# EAGLE design schematic (EAGLE 6.5.0)
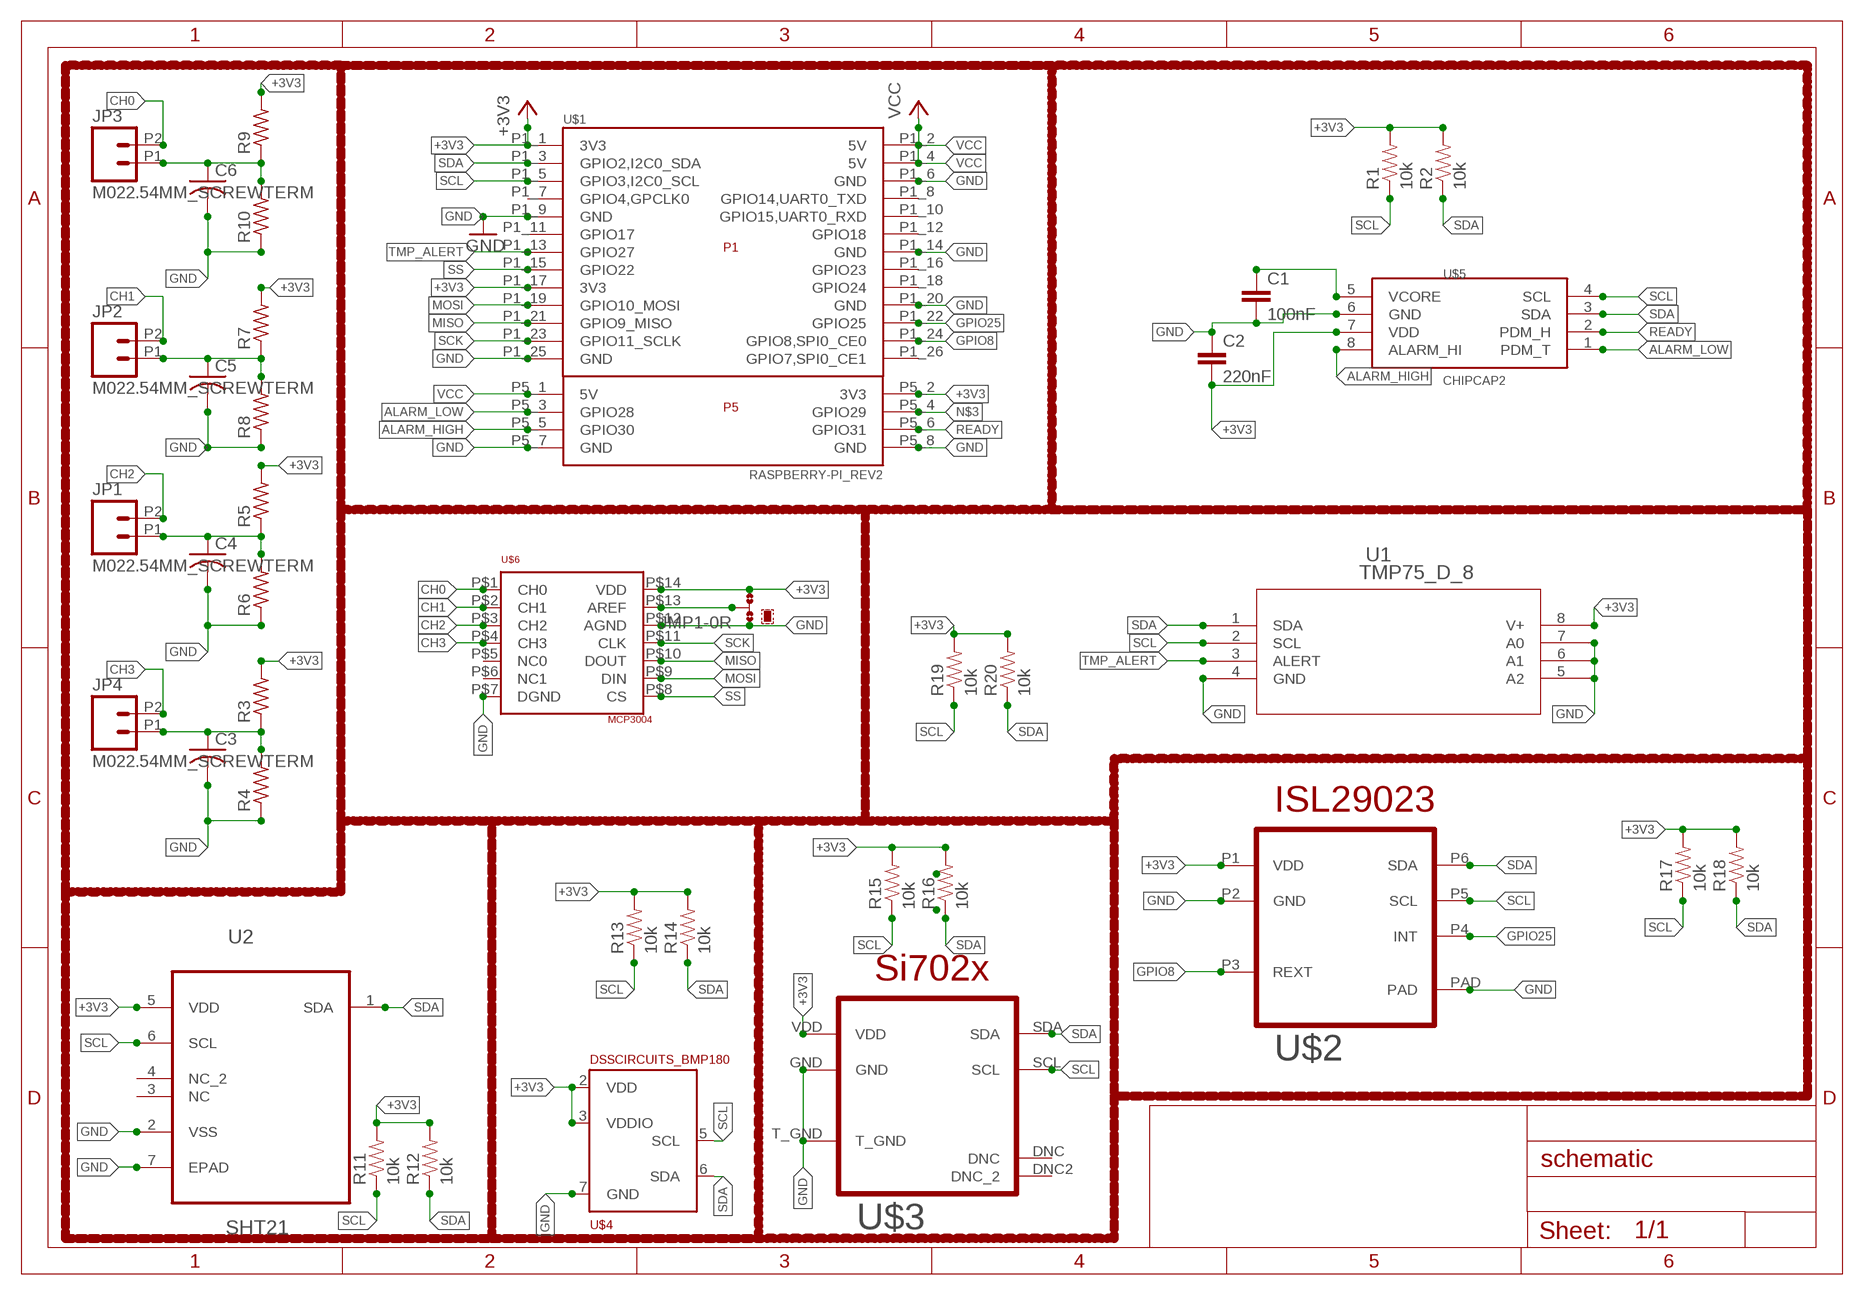
[diagram p0: schematic, sheet 1]

## Parts
C1  100nF  CAP0402-CAP  [0402-CAP]
C2  220nF  CAP0402-CAP  [0402-CAP]
C3  C-USC0402  [C0402]
C4  C-USC0402  [C0402]
C5  C-USC0402  [C0402]
C6  C-USC0402  [C0402]
JMP1  0R-JUMPA  [A0R-JMP]
JP1  M022.54MM_SCREWTERM  [1X02_2.54_SCREWTERM]
JP2  M022.54MM_SCREWTERM  [1X02_2.54_SCREWTERM]
JP3  M022.54MM_SCREWTERM  [1X02_2.54_SCREWTERM]
JP4  M022.54MM_SCREWTERM  [1X02_2.54_SCREWTERM]
R1  10k  RESISTOR0603  [0603-RES]
R2  10k  RESISTOR0603  [0603-RES]
R3  R-US_R0402  [R0402]
R4  R-US_R0402  [R0402]
R5  R-US_R0402  [R0402]
R6  R-US_R0402  [R0402]
R7  R-US_R0402  [R0402]
R8  R-US_R0402  [R0402]
R9  R-US_R0402  [R0402]
R10  R-US_R0402  [R0402]
R11  10k  RESISTOR0603  [0603-RES]
R12  10k  RESISTOR0603  [0603-RES]
R13  10k  RESISTOR0603  [0603-RES]
R14  10k  RESISTOR0603  [0603-RES]
R15  10k  RESISTOR0603  [0603-RES]
R16  10k  RESISTOR0603  [0603-RES]
R17  10k  RESISTOR0603  [0603-RES]
R18  10k  RESISTOR0603  [0603-RES]
R19  10k  RESISTOR0603  [0603-RES]
R20  10k  RESISTOR0603  [0603-RES]
U1  TMP75_D_8  [D8]
U2  SHT21  [DFN300X300X110-7N]
U$1  RASPBERRY-PI_REV2  [RASPBERRY-PI_REV2]
U$2  ISL29023  [ODFN6]
U$3  SI702X  [DFN6]
U$4  DSSCIRCUITS_BMP180  [DSSCIRCUITS_LGA7]
U$5  CHIPCAP2  [CHIPCAP2]
U$6  MCP3004  [TSSOP14_4MM4]

## Nets
+3V3 [PWR]: C2.2 JMP1.3 R1.2 R2.2 R3.2 R5.2 R7.2 R9.2 R11.2 R12.2 R13.2 R14.2 R15.2 R16.2 R17.2 R18.2 R19.2 R20.2 U1.8(V+) U2.5(VDD) U$1.P1_1(3V3) U$1.P1_17(3V3) U$1.P5_2(3V3) U$2.P1(VDD) U$3.VDD U$4.2(VDD) U$4.3(VDDIO) U$5.7(VDD) U$6.P$14(VDD)
ALARM_HIGH: U$1.P5_5(GPIO30) U$5.8(ALARM_HI)
ALARM_LOW: U$1.P5_3(GPIO28) U$5.1(PDM_T)
CH0: JP3.P2 U$6.P$1(CH0)
CH1: JP2.P2 U$6.P$2(CH1)
CH2: JP1.P2 U$6.P$3(CH2)
CH3: JP4.P2 U$6.P$4(CH3)
GND [PWR]: C1.2 C2.1 C3.2 C4.2 C5.2 C6.2 JMP1.1 R4.1 R6.1 R8.1 R10.1 U1.4(GND) U1.5(A2) U1.6(A1) U1.7(A0) U2.2(VSS) U2.7(EPAD) U$1.P1_6(GND) U$1.P1_9(GND) U$1.P1_14(GND) U$1.P1_20(GND) U$1.P1_25(GND) U$1.P5_7(GND) U$1.P5_8(GND) U$2.P2(GND) U$2.PAD U$3.GND U$3.T_GND U$4.7(GND) U$5.6(GND) U$6.P$7(DGND) U$6.P$12(AGND)
GPIO8: U$1.P1_24(GPIO8,SPI0_CE0) U$2.P3(REXT)
GPIO25: U$1.P1_22(GPIO25) U$2.P4(INT)
MISO: U$1.P1_21(GPIO9_MISO) U$6.P$10(DOUT)
MOSI: U$1.P1_19(GPIO10_MOSI) U$6.P$9(DIN)
N$1: C4.1 JP1.P1 R5.1 R6.2
N$2: C5.1 JP2.P1 R7.1 R8.2
N$3: U$1.P5_4(GPIO29)
N$4: C6.1 JP3.P1 R9.1 R10.2
N$5: C1.1 U$5.5(VCORE)
N$12: C3.1 JP4.P1 R3.1 R4.2
N$17: JMP1.2 U$6.P$13(AREF)
READY: U$1.P5_6(GPIO31) U$5.2(PDM_H)
SCK: U$1.P1_23(GPIO11_SCLK) U$6.P$11(CLK)
SCL: R1.1 R11.1 R13.1 R15.1 R17.1 R19.1 U1.2(SCL) U2.6(SCL) U$1.P1_5(GPIO3,I2C0_SCL) U$2.P5(SCL) U$3.SCL U$4.5(SCL) U$5.4(SCL)
SDA: R2.1 R12.1 R14.1 R16.1 R18.1 R20.1 U1.1(SDA) U2.1(SDA) U$1.P1_3(GPIO2,I2C0_SDA) U$2.P6(SDA) U$3.SDA U$4.6(SDA) U$5.3(SDA)
SS: U$1.P1_15(GPIO22) U$6.P$8(CS)
TMP_ALERT: U1.3(ALERT) U$1.P1_13(GPIO27)
VCC [PWR]: U$1.P1_2(5V) U$1.P1_4(5V) U$1.P5_1(5V)
Unconnected: U2.3(NC) U2.4(NC_2) U$1.P1_7(GPIO4,GPCLK0) U$1.P1_8(GPIO14,UART0_TXD) U$1.P1_10(GPIO15,UART0_RXD) U$1.P1_11(GPIO17) U$1.P1_12(GPIO18) U$1.P1_16(GPIO23) U$1.P1_18(GPIO24) U$1.P1_26(GPIO7,SPI0_CE1) U$3.DNC U$3.DNC2(DNC_2) U$4.1 U$4.4 U$6.P$5(NC0) U$6.P$6(NC1)

## Library data of the parts
C1 C2 = weatherpilot_lbr:CAP: Capacitor Standard 0603 ceramic capacitor, and 0.1" leaded capacitor.
C3-C6 = rcl:C-US: CAPACITOR, American symbol
JMP1 = jump-0r-smd:0R-JUMP: SMD 0R 0805 Jumper
JP1-JP4 = SparkFun-Connectors:M02: Standard 2-pin 0.1" header. Use with - straight break away headers ( PRT-00116) - right angle break away headers (PRT-00553) - swiss pins (PRT-00743) - machine pins (PRT-00117) - female headers (PRT-00115) Molex polarized connector foot print use with: PRT-08233 with associated crimp pins and housings. 2.54_SCREWTERM for use with PRT-10571. 3.5mm Screw Terminal footprints for PRT-08084 5mm Screw Terminal footprints for use with PRT-08433
R1 R2 R11-R20 = SparkFun-Resistors:RESISTOR: Resistor Basic schematic elements and footprints for 0603, 1206, and PTH resistors.
R3-R10 = rcl:R-US_: RESISTOR, American symbol
U1 = libraryPart:TMP75_D_8; DATASHEETURL: http://www.ti.com/lit/gpn/TMP75; DESCRIPTION: Digital Temperature Sensor with 2-Wire Interface; FAMILY_NAME: TEMPERATURE SENSOR; GENERIC_PART_NUMBER: TMP75; INDUSTRY_STD_PKG_TYPE: SOIC; MANUFACTURER: Texas Instruments; MANUFACTURER_PART_NUMBER: tmp75_d_8; PACKAGE_DESIGNATOR: D; PIN_COUNT: 8; VENDOR: Texas Instruments
U2 = weatherpilot_lbr:SHT21: SENSOR, HUMIDITY & TEMP; MPN: SHT21; OC_FARNELL: 1855468; OC_NEWARK: 20T1172; PACKAGE: DFN-6; SUPPLIER: SENSIRION
U$1 = RaspberryPi:RASPBERRY-PI_REV2: Raspberry Pi Board <http://www.raspberrypi.org/> Jacques Lagnel V1.0 (beta) 2012 Mateusz Bawaj V1.1 (beta) 2012 Board dimension: Forum 3D model <http://www.raspberrypi.org/forum/general-discussion/mechanical-profile-3d-models?value=3d%20model&type=1&include=1&search=1&ret=all> The GPIO Connector (P1): http://elinux.org/RPi_Low-level_peripherals The GPIO Connector (P5): http://www.raspberrypi-spy.co.uk/2012/09/raspberry-pi-p5-header/
U$2 = weatherpilot_lbr:ISL29023
U$3 = weatherpilot_lbr:SI702X
U$4 = BMP180_Breakout_PCB_Rev_B:DSSCIRCUITS_BMP180
U$5 = lib:CHIPCAP2
U$6 = lib:MCP3004: The Microchip Technology Inc. MCP3004/3008 devices are successive approximation 10-bit Analogto-Digital (A/D) converters with on-board sample and hold circuitry. The MCP3004 is programmable to provide two pseudo-differential input pairs or four single-ended inputs. The MCP3008 is programmable to provide four pseudo-differential input pairs or eight single-ended inputs. Differential Nonlinearity (DNL) and Integral Nonlinearity (INL) are specified at ±1 LSB. Communication with the devices is accomplished using a simple serial interface compatible with the SPI protocol. The devices are capable of conversion rates of up to 200 ksps. The MCP3004/3008 devices operate over a broad voltage range (2.7V - 5.5V). Low-current design permits operation with typical standby currents of only 5 nA and typical active currents of 320 µA. The MCP3004 is offered in 14-pin PDIP, 150 mil SOIC and TSSOP packages, while the MCP3008 is offered in 16-pin PDIP and SOIC packages. Features • 10-bit resolution • ± 1 LSB max DNL • ± 1 LSB max INL • 4 (MCP3004) or 8 (MCP3008) input channels • Analog inputs programmable as single-ended or pseudo-differential pairs • On-chip sample and hold • SPI serial interface (modes 0,0 and 1,1) • Single supply operation: 2.7V - 5.5V • 200 ksps max. sampling rate at VDD=5V • 75 ksps max. sampling rate at VDD=2.7V • Low power CMOS technology • 5 nA typical standby current, 2 µA max. • 500 µA max. active current at 5V • Industrial temp range: -40°C to +85°C • Available in PDIP, SOIC and TSSOP packages

## Net classes
0 default: width 0.203 mm, drill 0.305 mm, clearance 0.152 mm
1 PWR: width 0.305 mm, drill 0.305 mm, clearance 0.152 mm

## Board
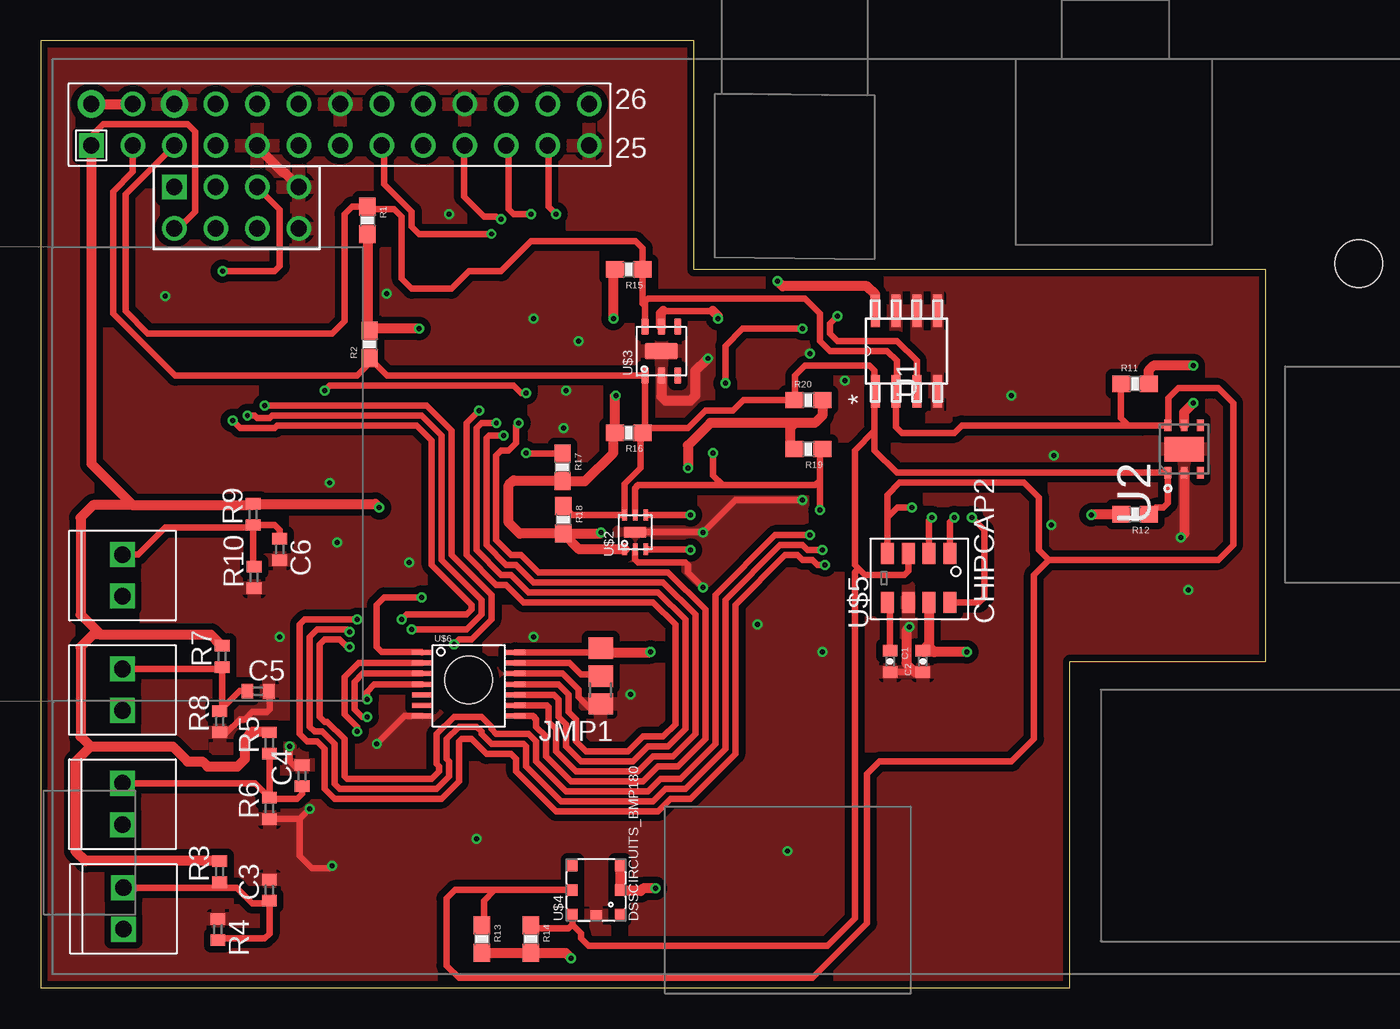
[diagram p1: board, top side]
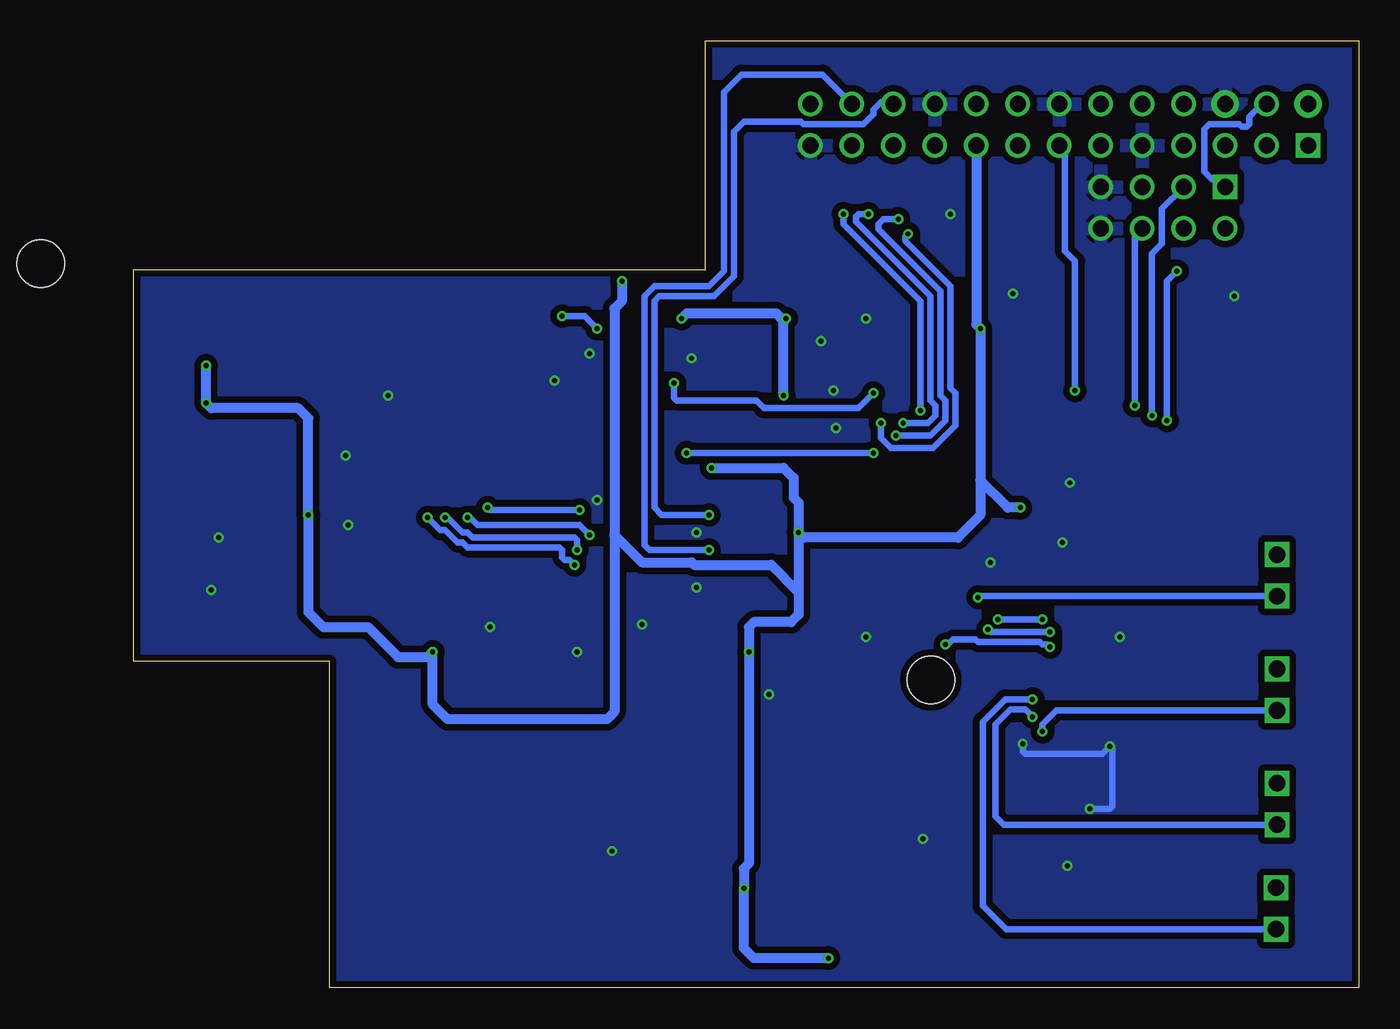
[diagram p2: board, bottom side, seen from below]

Size 75 x 58 mm. Coordinates in mm from the lower left corner, seen from the top.
Outline: 0,0 63,0 63,20 75,20 75,44 40,44 40,58 0,58 0,0
Copper layers (1*16): Top 0.035mm / dielectric 1.5mm / Bottom 0.035mm
Design rules "smart prototyping": minimum track width 6mil, minimum drill 12mil, track to track 6mil, track to pad 6mil, pad to pad 6mil, via to via 6mil, smd to smd 0mil, copper to edge 10mil, drill to drill 10mil, minimum pad ring 6mil, minimum via ring 6mil, stop-mask expansion 2mil, vias tented up to drill 25mil, thermal gap 10mil

### Footprints (pad centres in the part's own frame; a part is rotated, then mirrored left to right if it is on the bottom)
0402-CAP = smd 0.7 x 0.9: 1 -0.65,0; 2 0.65,0
C0402 = smd 0.7 x 0.9: 1 -0.65,0; 2 0.65,0
A0R-JMP = smd 1.5 x 1.3: 1 0,1.7; 2 0,0; 3 0,-1.7
1X02_2.54_SCREWTERM = drill 1.016 square: P1 2.54,0; P2 0,0
0603-RES = smd 1.1 x 1: 1 -0.85,0; 2 0.85,0
R0402 = smd 0.7 x 0.9: 1 -0.65,0; 2 0.65,0
D8 = smd 1.981 x 0.559: 1 -2.464,1.905; 2 -2.464,0.635; 3 -2.464,-0.635; 4 -2.464,-1.905; 5 2.464,-1.905; 6 2.464,-0.635; 7 2.464,0.635; 8 2.464,1.905
DFN300X300X110-7N = smd 0.711 x 0.406: 1 -1.448,0.991; 2 -1.448,0; 3 -1.448,-0.991; 4 1.448,-0.991; 5 1.448,0; 6 1.448,0.991 | smd 1.499 x 2.388: 7 0,0
RASPBERRY-PI_REV2 = drill 1 square: P1_1 -41.91,21.59; P5_1 -36.83,19.05 | drill 1 pad 1.676: P1_2 -41.91,24.13; P1_6 -36.83,24.13 | drill 1: P1_3 -39.37,21.59; P1_4 -39.37,24.13; P1_5 -36.83,21.59; P1_7 -34.29,21.59; P1_8 -34.29,24.13; P1_9 -31.75,21.59; P1_10 -31.75,24.13; P1_11 -29.21,21.59; P1_12 -29.21,24.13; P1_13 -26.67,21.59; P1_14 -26.67,24.13; P1_15 -24.13,21.59; P1_16 -24.13,24.13; P1_17 -21.59,21.59; P1_18 -21.59,24.13; P1_19 -19.05,21.59; P1_20 -19.05,24.13; P1_21 -16.51,21.59; P1_22 -16.51,24.13; P1_23 -13.97,21.59; P1_24 -13.97,24.13; P1_25 -11.43,21.59; P1_26 -11.43,24.13; P5_2 -36.83,16.51; P5_3 -34.29,19.05; P5_4 -34.29,16.51; P5_5 -31.75,19.05; P5_6 -31.75,16.51; P5_7 -29.21,19.05; P5_8 -29.21,16.51 | hole 2.9: 35.69,14.365; -18.81,-11.135
ODFN6 = smd 0.7 x 0.35: P1 -1.05,0.65; P2 -1.05,0; P3 -1.05,-0.65; P4 1.05,-0.65; P5 1.05,0; P6 1.05,0.65 | smd 0.65 x 1.35: PAD 0,0
DFN6 = smd 1 x 0.45: DNC -1.5,-1; DNC2 1.5,-1; GND -1.5,0; SCL 1.5,1; SDA -1.5,1; VDD 1.5,0 | smd 1 x 2: T_GND 0,0
DSSCIRCUITS_LGA7 = smd 0.7 x 0.6: 1 -1.5,-1.45; 2 0,-1.45; 3 1.5,-1.45; 4 1.5,1.45; 5 0,1.45; 6 -1.5,1.45 | smd 0.6 x 0.7: 7 -1.55,0
CHIPCAP2 = smd 1.27 x 0.8: 1 1.603,-1.651; 2 1.603,-0.381; 3 1.603,0.889; 4 1.603,2.159; 5 -1.397,2.159; 6 -1.397,0.889; 7 -1.397,-0.381; 8 -1.397,-1.651
TSSOP14_4MM4 = smd 1.25 x 0.3: P$1 -0.65,4.55; P$2 -0.65,3.9; P$3 -0.65,3.25; P$4 -0.65,2.6; P$5 -0.65,1.95; P$6 -0.65,1.3; P$7 -0.65,0.65; P$8 5.05,0.65; P$9 5.05,1.3; P$10 5.05,1.95; P$11 5.05,2.6; P$12 5.05,3.25; P$13 5.05,3.9; P$14 5.05,4.55

### Placement (x,y rotation side)
C1  52,20 270 top
C2  54,20 90 top
C3  14,6 90 top
C4  16,13 90 top
C5  13.31,18.18 0 top
C6  14.63,26.85 270 top
JMP1  34.28,19.1 180 top
JP1  5,10 90 top
JP2  5,17 90 top
JP3  5,24 90 top
JP4  5.06,3.6 90 top
R1  20,47 270 top
R2  20.13,39.41 90 top
R3  10.95,7.13 90 top
R4  10.85,3.58 270 top
R5  14,15 90 top
R6  14,11 90 top
R7  11.1,20.3 90 top
R8  10.95,16.31 90 top
R9  13,29 90 top
R10  13.06,25.14 90 top
R11  67,37 0 top
R12  67,29 180 top
R13  27,3 270 top
R14  30,3 270 top
R15  36,44 180 top
R16  36,34 180 top
R17  31.94,31.89 270 top
R18  32,28.68 270 top
R19  47,33 180 top
R20  47,36 0 top
U1  53,39 90 top
U2  70,33 90 top
U$1  45,30 0 top
U$2  36.39,27.91 90 top
U$3  38,39 90 top
U$4  34,6 90 top
U$5  54,25 90 top
U$6  24,16 0 top

### Tracks (layer width: path | path; a pad name or v marks a point on that pad's centre or on a via)
+3V3  (via drill 0.3)
  Top 0.406: U$6.P$14 34.02,20.55 JMP1.3 | 41.15,41.45 38.1,41.45 | U$1.P5_2 8.41,46.51 9.45,47.55 9.45,52.43 8.99,52.88 3.81,52.88 3.05,52.12 3.05,51.63 U$1.P1_1
  Top 0.61: U$1.P1_1 3.09,32.11 5.64,29.57 | 5.64,29.57 12.92,29.57 R9.2 20.49,29.65 v20.73,29.41 | 5.64,29.57 3.2,29.57 2.44,28.8 2.44,22.86 3.66,21.64 | 3.66,21.64 10.36,21.64 | 10.36,21.64 10.41,21.64 R7.2 11.05,20.95 10.36,21.64 | 3.66,21.64 3.2,21.64 2.44,20.88 2.44,15.39 3.05,14.78 | 3.05,14.78 8.08,14.78 8.99,13.87 9.91,13.87 10.21,13.56 12.04,13.56 12.5,14.02 12.5,15.24 12.95,15.7 13.95,15.7 R5.2 | R3.2 2.74,7.78 2.13,8.38 2.13,13.87 3.05,14.78 | R13.2 R14.2 32.14,2.15 v32.46,1.83 | v37.64,6.1 36.88,6.1 36.73,5.94 35.51,5.94 U$4.2 U$4.3 | 34.02,20.55 37.31,20.55 v37.34,20.57 | U$2.P1 32.96,26.86 R18.2 | R18.2 34.23,27.83 v34.29,27.89 | R18.2 29.32,27.83 28.65,28.5 28.65,30.79 28.96,31.09 31.89,31.09 R17.2 33.32,31.04 35.05,32.77 35.05,33.9 R16.2 35.15,36.22 v35.2,36.27 | v35.05,41 35.05,43.9 R15.2 | v41.45,41 41.45,41.15 41.15,41.45 | 38.1,41.45 37.95,41.3 37.95,40.55 U$3.VDD | R20.2 47.85,35.05 47.4,34.59 46.18,34.59 | 46.18,34.59 45.87,34.29 45.87,33.28 R19.2 | 46.18,34.59 41,34.59 39.62,33.22 v39.62,31.85 | U1.8 51.09,42.48 50.6,42.98 45.41,42.98 v45.11,43.28 | U2.5 70,35.25 v70.56,35.81 | v70.56,38.1 68.12,38.1 67.82,37.8 67.82,37.03 R11.2 | R12.2 64.36,29 v64.31,28.96 | v56.69,20.57 54.71,20.57 | 54.71,20.57 54.08,20.57 C2.2 54.38,21.03 U$5.7 54.38,20.91 54.71,20.57 | v23.16,40.39 20.25,40.39 R2.2 20,40.39 R1.2
  Bottom 0.61: v32.46,1.83 37.03,1.83 37.64,2.44 v37.64,6.1 37.64,7.32 37.34,7.62 v37.34,20.57 37.34,22.1 37.03,22.4 34.75,22.4 34.29,22.86 34.29,24.23 | v34.29,27.89 34.29,24.23 | v35.2,36.27 35.2,40.84 | 35.2,40.84 v35.05,41 | 35.2,40.84 35.66,41.3 41.15,41.3 v41.45,41 | v39.62,31.85 35.2,31.85 34.59,31.24 34.59,30.02 34.29,29.72 v34.29,27.89 | v45.11,43.28 45.11,42.06 45.57,41.6 45.57,27.74 | 45.57,27.74 43.89,26.06 40.84,26.06 40.69,25.91 35.97,25.91 34.29,24.23 | v70.56,38.1 v70.56,35.81 70.26,35.51 64.92,35.51 64.31,34.9 v64.31,28.96 64.31,23.01 63.4,22.1 60.66,22.1 58.83,20.27 57,20.27 v56.69,20.57 56.69,17.37 55.78,16.46 46.02,16.46 45.57,16.92 45.57,27.74 | U$1.P1_17 23.41,40.63 v23.16,40.39 23.16,31.09 | 23.16,31.09 23.16,28.96 24.54,27.58 33.98,27.58 v34.29,27.89 | v20.73,29.41 21.49,29.41 23.16,31.09
ALARM_HIGH  (via drill 0.3)
  Top 0.406: U$5.8 57.44,23.6 57.76,23.93 57.76,28.04 v57,28.8 | v48.01,25.91 47.55,25.91 47.24,26.21 46.63,26.21 46.33,26.52 45.57,26.52 42.52,23.47 42.52,14.33 39.78,11.58 38.56,11.58 37.8,10.82 31.55,10.82 29.11,13.26 29.11,14.02 28.8,14.33 27.28,14.33 26.36,15.24 25.76,15.24 25.6,15.09 25.6,12.65 24.54,11.58 17.98,11.58 17.37,12.19 17.37,14.63 16.92,15.09 16.31,15.09 15.85,15.54 15.85,22.25 16.15,22.55 v19.36,22.55 | v11.73,34.75 12.19,34.29 14.33,34.29 14.48,34.44 23.01,34.44 23.93,33.53 23.93,25.91 26.36,23.47 26.36,23.16 26.06,22.86 22.4,22.86 v22.1,22.55 | v11.12,43.89 14.33,43.89 14.63,44.2 14.63,47.67 U$1.P5_5
  Bottom 0.406: v57,28.8 56.24,28.04 55.93,28.04 55.17,27.28 54.86,27.28 54.56,26.98 48.92,26.98 48.77,26.82 48.77,26.36 48.62,26.21 48.31,26.21 v48.01,25.91 | v11.73,34.75 11.73,43.28 v11.12,43.89 | v22.1,22.55 v19.36,22.55
ALARM_LOW  (via drill 0.3)
  Top 0.406: U$5.1 55.65,28.52 v55.93,28.8 | v47.85,26.82 46.94,26.82 46.63,27.13 45.26,27.13 41.91,23.77 41.91,14.63 39.47,12.19 38.25,12.19 37.49,11.43 31.85,11.43 29.72,13.56 29.72,14.78 29.57,14.94 27.58,14.94 26.98,15.54 26.98,15.7 26.67,16 25.6,16 24.84,15.24 24.84,14.02 24.99,13.87 24.99,12.95 24.23,12.19 18.29,12.19 17.98,12.5 17.98,14.94 17.22,15.7 16.76,15.7 16.46,16 16.46,21.49 16.92,21.95 18.75,21.95 v18.9,21.79 | v12.65,35.05 13.11,35.05 13.26,34.9 14.02,34.9 14.17,35.05 23.32,35.05 24.54,33.83 24.54,26.21 26.98,23.77 26.98,22.86 26.06,21.95 v22.71,21.95
  Bottom 0.406: v55.93,28.8 55.78,28.8 54.86,27.89 54.56,27.89 54.25,27.58 48.01,27.58 47.85,27.43 v47.85,26.82 | v12.65,35.05 12.65,44.96 12.04,45.57 12.04,47.72 U$1.P5_3 | v18.9,21.79 22.55,21.79 v22.71,21.95
CH0  (via drill 0.3)
  Top 0.406: v23.32,23.93 21.03,23.93 20.57,23.47 20.57,20.88 20.88,20.57 23.33,20.57 U$6.P$1
  Bottom 0.406: JP3.P2 23.24,24 v23.32,23.93
CH1  (via drill 0.3)
  Top 0.406: v19.36,15.7 19.36,16 18.59,16.76 18.59,19.05 19.44,19.9 U$6.P$2
  Bottom 0.406: JP2.P2 18.51,17 19.36,16.15 v19.36,15.7
CH2  (via drill 0.3)
  Top 0.406: v19.96,16.61 19.66,16.61 19.2,17.07 19.2,18.75 19.71,19.25 U$6.P$3
  Bottom 0.406: JP1.P2 21.73,10 22.25,10.52 22.25,16.15 21.34,17.07 20.42,17.07 v19.96,16.61
CH3  (via drill 0.3)
  Top 0.406: v19.96,17.68 19.96,18.14 20.42,18.59 U$6.P$4
  Bottom 0.406: JP4.P2 21.58,3.6 23.01,5.03 23.01,16.31 21.64,17.68 v19.96,17.68
GND  (via drill 0.3)
  Top 0.406: U$6.P$12 31.96,19.25 32.92,18.29 32.92,17.83 33.53,17.22 34.1,17.22 JMP1.1 | C1.2 C2.1 | U$6.P$7 22.29,16.65 v20.57,14.94 | v15.24,14.78 15.24,13.87 15.54,13.56 15.91,13.56 C4.2 | R6.1 15.84,10.35 | 15.84,10.35 v16.46,10.97 | 15.84,10.35 15.84,8.09 16.61,7.32 17.68,7.32 v17.83,7.47 | U$2.PAD 40.51,27.91 v40.54,27.89 42.52,29.87 v46.63,29.87 | U$2.P2 36.39,26.25 36.58,26.06 39.47,26.06 39.62,25.91 39.62,25.45 v40.54,24.54 | R8.1 11.39,15.66 12.19,16.46 12.5,16.46 12.95,16.92 13.87,16.92 14.02,17.07 14.02,18.12 C5.2
  Top 0.61: U$1.P1_9 13.25,51.52 14.78,49.99 14.85,49.99 U$1.P5_7 | C2.1 53.5,19.35 53.03,19.81 53.03,21.95 v53.19,22.1 | U2.2 70,27.79 v69.8,27.58 | U$3.GND 38,36.22 38.25,35.97 39.78,35.97 40.08,36.27 40.08,37.8 v40.84,38.56
  Bottom 0.406: v20.57,14.94 20.57,14.48 20.42,14.33 15.7,14.33 v15.24,14.78 15.09,14.63 15.09,11.12 15.24,10.97 v16.46,10.97
  other vias: 7.62,42.37 59.44,36.27 49.23,37.19 47.09,38.86 47.85,20.57 24.99,47.4 32.92,39.62 32,34.29 32.16,36.58 36.12,17.98 43.89,22.25 61.87,28.35 70.26,24.38 45.72,8.38 26.67,9.14 18.14,27.28 22.56,26.06 14.63,21.49 30.18,41 21.18,42.52 17.68,30.94 30.18,21.49 62.03,32.61
  pour Bottom (isolate 0.406): 0.46,57.45 39.47,57.45 39.47,55.63 39.47,43.59 74.68,43.59 74.68,20.42 62.64,20.42 62.64,0.46 0.15,0.46 0.15,57.45 0.3,57.45
  pour Top (isolate 0.406): -2.13,60.05 41.45,60.05 41.45,44.81 77.42,44.81 77.42,18.14 67.21,18.14 67.21,-2.59 -2.13,-2.59
GPIO8  (via drill 0.3)
  Top 0.406: U$2.P3 39.73,26.86 v39.78,26.82
  Bottom 0.406: v39.78,26.82 43.43,26.82 43.74,27.13 43.74,42.37 43.13,42.98 39.78,42.98 38.86,43.89 38.86,54.86 37.8,55.93 32.83,55.93 U$1.P1_24
GPIO25  (via drill 0.3)
  Top 0.406: U$2.P4 39.77,28.96 v39.78,28.96
  Bottom 0.406: v39.78,28.96 42.67,28.96 43.13,29.41 43.13,42.06 42.82,42.37 39.47,42.37 38.25,43.59 38.25,52.43 37.64,53.03 34.14,53.03 33.98,52.88 30.33,52.88 29.72,53.49 29.72,53.8 29.26,54.25 28.61,54.25 U$1.P1_22
MISO  (via drill 0.3)
  Top 0.406: U$6.P$10 31.43,17.95 31.7,17.68 31.7,16.61 32.16,16.15 32.16,14.78 33.07,13.87 36.27,13.87 37.19,14.78 38.41,14.78 39.47,15.85 39.47,22.55 37.8,24.23 29.87,24.23 28.8,25.3 28.19,25.3 26.67,26.82 26.67,34.29 26.98,34.59 v27.89,34.59 | v30.02,47.4 28.96,47.4 28.65,47.7 28.65,51.43 U$1.P1_21
  Bottom 0.406: v27.89,34.59 26.36,34.59 25.91,35.05 25.91,35.66 26.21,35.97 26.21,42.37 30.79,46.94 30.79,47.24 30.63,47.4 v30.02,47.4
MOSI  (via drill 0.3)
  Top 0.406: U$6.P$9 31.01,17.3 31.09,17.22 31.09,16.31 31.55,15.85 31.55,14.48 32.77,13.26 36.58,13.26 37.49,14.17 38.71,14.17 40.08,15.54 40.08,22.86 38.1,24.84 30.18,24.84 29.11,25.91 28.5,25.91 27.28,27.13 27.28,33.68 27.43,33.83 v28.35,33.83 | v28.19,47.09 28.04,47.09 27.89,47.24 27.13,47.24 25.91,48.46 25.91,51.55 U$1.P1_19
  Bottom 0.406: v28.35,33.83 26.21,33.83 25.3,34.75 25.3,35.97 25.6,36.27 25.6,42.67 29.41,46.48 29.41,46.79 29.11,47.09 v28.19,47.09
N$1
  Top 0.406: JP1.P1 13.11,12.54 R6.2 | R5.1 R6.2 | C4.1 16,11.88 15.7,11.58 14.07,11.58 R6.2
N$2
  Top 0.406: JP2.P1 10.99,19.54 R7.1 11.1,17.11 R8.2 12.17,18.18 C5.1
N$4
  Top 0.406: JP3.P1 5.97,26.54 7.62,28.19 12.84,28.19 R9.1 | R9.1 13,25.85 R10.2 | C6.1 14.63,28.04 14.33,28.35 R9.1
N$5
  Top 0.406: C1.1 52,23.44 U$5.5
N$12
  Top 0.406: JP4.P1 10.61,6.14 | 13.98,5.33 C3.1 | C3.1 14,3.33 13.72,3.05 10.96,3.05 R4.2 | 10.61,6.14 R3.1 | 10.61,6.14 11.99,6.14 12.95,5.18 13.83,5.18 C3.1
N$17
  Top 0.406: U$6.P$13 32.37,19.9 33.07,19.2 34.17,19.2 JMP1.2
READY  (via drill 0.3)
  Top 0.406: U$5.2 54.38,28.62 v54.56,28.8 | v47.09,27.74 44.96,27.74 41.3,24.08 41.3,14.94 39.17,12.8 37.95,12.8 37.19,12.04 32.16,12.04 30.33,13.87 30.33,15.09 29.87,15.54 27.89,15.54 27.58,15.85 27.58,16 26.98,16.61 25.3,16.61 24.23,15.54 24.23,13.72 24.38,13.56 24.38,13.26 23.93,12.8 18.75,12.8 18.59,12.95 18.59,15.24 17.53,16.31 17.37,16.31 17.07,16.61 17.07,21.03 17.37,21.34 18.29,21.34 18.75,20.88 v18.9,20.88 | v13.72,35.66 23.62,35.66 25.15,34.14 25.15,26.52 27.58,24.08 27.58,22.55 26.36,21.34 25.6,21.34 v25.3,21.03
  Bottom 0.406: v54.56,28.8 54.41,28.8 53.95,28.35 47.7,28.35 v47.09,27.74 | v13.72,35.66 13.72,46.04 U$1.P5_6 | v25.3,21.03 25.15,21.03 24.84,21.34 23.47,21.34 23.32,21.18 19.51,21.18 19.36,21.03 19.05,21.03 v18.9,20.88
SCK  (via drill 0.3)
  Top 0.406: U$6.P$11 31.69,18.6 32.31,17.98 32.31,16.92 32.77,16.46 32.77,15.09 33.38,14.48 35.97,14.48 36.88,15.39 38.1,15.39 38.86,16.15 38.86,22.25 37.49,23.62 29.57,23.62 28.5,24.69 27.89,24.69 26.06,26.52 26.06,34.59 v26.82,35.36 | v31.55,47.4 31.09,47.85 31.09,51.53 U$1.P1_23
  Bottom 0.406: v26.82,35.36 26.82,42.06 31.55,46.79 v31.55,47.4
SCL  (via drill 0.3)
  Top 0.406: 67.51,34.45 U2.6 69.04,34.48 69.04,36.12 69.65,36.73 72.08,36.73 73,35.81 73,27.13 72.08,26.21 61.72,26.21 | 67.51,34.45 66.59,34.45 66.14,34.9 R11.1 | 67.51,34.45 67.51,34.44 56.39,34.44 55.93,33.98 52.73,33.98 52.37,34.35 U1.2 52.43,36.6 52.43,38.41 51.82,39.01 48.31,39.01 47.7,39.62 47.7,41.3 46.79,42.22 37.19,42.22 37,42.03 37,41.76 | U$3.SCL 37,41.76 | 37,41.76 36.85,41.91 R15.1 36.85,45.29 36.42,45.72 30.02,45.72 28.19,43.89 26.21,43.89 25.15,42.82 22.71,42.82 22.1,43.43 22.1,47.24 21.64,47.7 20.15,47.7 R1.1 19.05,47.85 18.59,47.4 18.59,40.84 17.83,40.08 6.55,40.08 5.18,41.45 5.18,48.6 U$1.P1_5 | U$5.4 51.84,28.8 | 51.84,28.8 51.84,30.2 52.58,30.94 60.2,30.94 61.11,30.02 61.11,26.82 61.72,26.21 | R13.1 27.13,3.98 27.13,5.33 27.79,6 U$4.5 25.36,6 24.84,5.49 24.84,1.37 25.6,0.61 47.24,0.61 50.6,3.96 50.6,13.11 51.36,13.87 59.44,13.87 60.81,15.24 60.81,25.3 61.72,26.21 | U$2.P5 36.39,30.6 36.58,30.79 41.76,30.79 | 41.76,30.79 47.4,30.79 47.7,31.09 | 47.7,31.09 47.7,32.85 R19.1 | R17.1 29.75,32.73 v29.72,32.77 | v41.15,32.77 41.15,31.39 41.76,30.79 | 47.7,31.09 v47.7,29.26 | v53.34,29.41 52.45,29.41 51.84,28.8
  Bottom 0.406: v29.72,32.77 v41.15,32.77 | v47.7,29.26 53.19,29.26 v53.34,29.41
SDA
  Top 0.406: 51.05,34.14 51.05,32.92 52.42,31.55 U2.1 69.01,29.69 68.73,29.41 68.26,29.41 R12.1 | 51.05,34.14 51.05,36.49 | 51.05,36.49 U1.1 | 51.05,36.49 51.05,37.8 50.75,38.1 46.79,38.1 46.18,37.49 46.18,36.03 R20.1 43.01,36 42.37,35.36 40.69,35.36 39.62,34.29 37.14,34.29 R16.1 | R16.1 37,34.15 U$3.SDA 21.19,37.5 R2.1 20.13,38.27 19.36,37.49 8.23,37.49 4.42,41.3 4.42,48.77 5.64,49.99 U$1.P1_3 | U$5.3 53.11,25.53 52.88,25.3 50.44,25.3 50.06,25.68 | 50.06,25.68 49.84,25.91 49.84,32.92 51.05,34.14 | R14.1 30.19,3.66 32.31,3.66 32.55,3.9 U$4.6 32.55,3.87 33.07,3.35 33.07,3.05 33.53,2.59 48.16,2.59 49.84,4.27 49.84,25.45 50.06,25.68 | R16.1 36.73,33.88 36.73,31.85 35.74,30.86 U$2.P6 32.56,28.96 R18.1
SS  (via drill 0.3)
  Top 0.406: U$6.P$8 30.14,16.65 30.33,16.46 30.33,16 30.94,15.39 30.94,14.17 32.46,12.65 36.88,12.65 37.8,13.56 39.01,13.56 40.69,15.24 40.69,23.16 38.41,25.45 30.48,25.45 29.41,26.52 28.8,26.52 27.89,27.43 27.89,32.61 28.19,32.92 28.65,32.92 29.11,33.38 29.11,34.44 v29.26,34.59 | v27.58,46.18 23.16,46.18 22.71,46.63 22.71,47.55 21.03,49.23 21.03,51.43 U$1.P1_15
  Bottom 0.406: v29.26,34.59 29.26,33.68 28.65,33.07 26.06,33.07 24.69,34.44 24.69,36.42 24.99,36.73 24.99,42.98 27.74,45.72 27.74,46.02 v27.58,46.18
TMP_ALERT  (via drill 0.3)
  Top 0.406: U1.3 53.63,38.41 52.43,39.62 48.77,39.62 48.31,40.08 48.31,40.69 v48.77,41.15 | v46.63,40.39 42.98,40.39 41.91,39.32 v41.91,37.03 | v29.72,36.42 29.41,36.42 28.96,36.88 17.68,36.88 v17.37,36.58
  Bottom 0.406: v48.77,41.15 47.4,41.15 v46.63,40.39 | v41.91,37.03 41.91,36.12 41.76,35.97 36.88,35.97 36.42,35.51 30.63,35.51 v29.72,36.42 | v17.37,36.58 17.37,44.5 17.98,45.11 17.98,51.24 U$1.P1_13
VCC
  Top 0.61: U$1.P1_2 U$1.P1_4
  Bottom 0.406: U$1.P1_4 5.92,54.13 6.71,53.34 6.71,52.88 6.86,52.73 7.16,52.73 7.32,52.88 9.14,52.88 9.45,52.58 9.45,49.99 8.99,49.53 8.65,49.53 U$1.P5_1